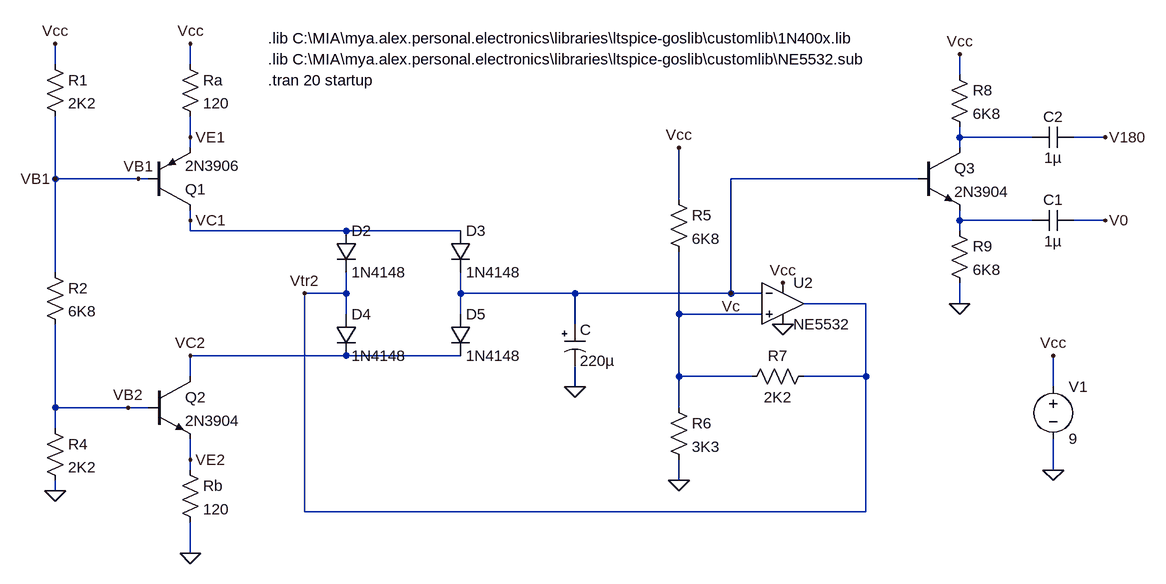
[diagram p0: schematic triangular-wave-generator.asc]
triangular-wave-generator.asc, the LTspice schematic file:
Version 4
SHEET 1 1076 740
WIRE -1696 -192 -1696 -224
WIRE -1488 -192 -1488 -224
WIRE -304 -176 -304 -208
WIRE -1488 -80 -1488 -112
WIRE -304 -80 -304 -96
WIRE -192 -80 -304 -80
WIRE -80 -80 -128 -80
WIRE -1488 -64 -1488 -80
WIRE -304 -64 -304 -80
WIRE -1696 -16 -1696 -112
WIRE -1568 -16 -1696 -16
WIRE -1552 -16 -1568 -16
WIRE -368 -16 -656 -16
WIRE -736 16 -736 -64
WIRE -1488 48 -1488 32
WIRE -304 48 -304 32
WIRE -192 48 -304 48
WIRE -80 48 -128 48
WIRE -1488 64 -1488 48
WIRE -1248 64 -1488 64
WIRE -1072 64 -1248 64
WIRE -304 64 -304 48
WIRE -1696 128 -1696 -16
WIRE -1248 160 -1248 128
WIRE -1248 160 -1312 160
WIRE -1072 160 -1072 128
WIRE -896 160 -1072 160
WIRE -656 160 -656 -16
WIRE -656 160 -896 160
WIRE -608 160 -656 160
WIRE -448 176 -544 176
WIRE -304 176 -304 144
WIRE -1248 192 -1248 160
WIRE -1072 192 -1072 160
WIRE -736 192 -736 96
WIRE -608 192 -736 192
WIRE -896 208 -896 160
WIRE -1248 256 -1488 256
WIRE -1072 256 -1248 256
WIRE -1488 288 -1488 256
WIRE -736 288 -736 192
WIRE -624 288 -736 288
WIRE -448 288 -448 176
WIRE -448 288 -544 288
WIRE -896 304 -896 272
WIRE -160 304 -160 256
WIRE -1696 336 -1696 208
WIRE -1584 336 -1696 336
WIRE -1552 336 -1584 336
WIRE -736 336 -736 288
WIRE -1696 368 -1696 336
WIRE -1488 416 -1488 384
WIRE -1488 432 -1488 416
WIRE -160 432 -160 384
WIRE -736 448 -736 416
WIRE -1696 464 -1696 448
WIRE -1312 496 -1312 160
WIRE -448 496 -448 288
WIRE -448 496 -1312 496
WIRE -1488 560 -1488 512
FLAG -160 432 0
FLAG -896 304 0
FLAG -1488 -224 Vcc
FLAG -1696 -224 Vcc
FLAG -1488 48 VC1
FLAG -1696 -16 VB1
FLAG -160 256 Vcc
FLAG -1488 -80 VE1
FLAG -656 160 Vc
FLAG -1488 560 0
FLAG -1696 464 0
FLAG -1312 160 Vtr2
FLAG -1488 256 VC2
FLAG -1488 416 VE2
FLAG -1584 336 VB2
FLAG -1568 -16 VB1
FLAG -576 144 Vcc
FLAG -576 208 0
FLAG -736 448 0
FLAG -736 -64 Vcc
FLAG -304 176 0
FLAG -80 -80 V180
FLAG -80 48 V0
FLAG -304 -208 Vcc
SYMBOL voltage -160 288 R0
WINDOW 123 0 0 Left 0
WINDOW 39 0 0 Left 0
SYMATTR InstName V1
SYMATTR Value 9
SYMBOL pnp -1552 32 M180
SYMATTR InstName Q1
SYMATTR Value 2N3906
SYMBOL res -1504 -208 R0
SYMATTR InstName Ra
SYMATTR Value 120
SYMBOL polcap -912 208 R0
WINDOW 3 24 56 Left 2
SYMATTR Value 220µ
SYMATTR InstName C
SYMATTR Description Capacitor
SYMATTR Type cap
SYMBOL res -1712 112 R0
SYMATTR InstName R2
SYMATTR Value 6K8
SYMBOL diode -1264 64 R0
SYMATTR InstName D2
SYMATTR Value 1N4148
SYMBOL diode -1088 64 R0
SYMATTR InstName D3
SYMATTR Value 1N4148
SYMBOL diode -1264 192 R0
SYMATTR InstName D4
SYMATTR Value 1N4148
SYMBOL diode -1088 192 R0
SYMATTR InstName D5
SYMATTR Value 1N4148
SYMBOL npn -1552 288 R0
SYMATTR InstName Q2
SYMATTR Value 2N3904
SYMBOL res -1504 416 R0
SYMATTR InstName Rb
SYMATTR Value 120
SYMBOL res -1712 -208 R0
SYMATTR InstName R1
SYMATTR Value 2K2
SYMBOL res -1712 352 R0
SYMATTR InstName R4
SYMATTR Value 2K2
SYMBOL res -752 0 R0
SYMATTR InstName R5
SYMATTR Value 6K8
SYMBOL res -752 320 R0
SYMATTR InstName R6
SYMATTR Value 3K3
SYMBOL res -528 272 R90
WINDOW 0 0 56 VBottom 2
WINDOW 3 32 56 VTop 2
SYMATTR InstName R7
SYMATTR Value 2K2
SYMBOL OpAmps\\opamp2 -576 112 R0
SYMATTR InstName U2
SYMATTR Value NE5532
SYMBOL npn -368 -64 R0
SYMATTR InstName Q3
SYMATTR Value 2N3904
SYMBOL res -320 48 R0
SYMATTR InstName R9
SYMATTR Value 6K8
SYMBOL res -320 -192 R0
SYMATTR InstName R8
SYMATTR Value 6K8
SYMBOL cap -128 -96 R90
WINDOW 0 0 32 VBottom 2
WINDOW 3 32 32 VTop 2
SYMATTR InstName C2
SYMATTR Value 1µ
SYMBOL cap -128 32 R90
WINDOW 0 0 32 VBottom 2
WINDOW 3 32 32 VTop 2
SYMATTR InstName C1
SYMATTR Value 1µ
TEXT -1368 -168 Left 2 !.tran 20 startup
TEXT -1368 -232 Left 2 !.lib C:\\MIA\\mya.alex.personal.electronics\\libraries\\ltspice-goslib\\customlib\\1N400x.lib
TEXT -1368 -200 Left 2 !.lib C:\\MIA\\mya.alex.personal.electronics\\libraries\\ltspice-goslib\\customlib\\NE5532.sub

The netlist it stands for:
* triangular-wave-generator.asc
V1 Vcc 0 9
Q1 VC1 VB1 VE1 0 2N3906
Ra Vcc VE1 120
C Vc 0 220µ
R2 VB1 VB2 6K8
D2 VC1 Vtr2 1N4148
D3 VC1 Vc 1N4148
D4 Vtr2 VC2 1N4148
D5 Vc VC2 1N4148
Q2 VC2 VB2 VE2 0 2N3904
Rb VE2 0 120
R1 Vcc VB1 2K2
R4 VB2 0 2K2
R5 Vcc N003 6K8
R6 N003 0 3K3
R7 Vtr2 N003 2K2
XU2 N003 Vc Vcc 0 Vtr2 NE5532  ; pins In+ In- V+ V- OUT
Q3 N001 Vc N002 0 2N3904
R9 N002 0 6K8
R8 Vcc N001 6K8
C2 V180 N001 1µ
C1 V0 N002 1µ
.model D D
.lib standard.dio
.model NPN NPN
.model PNP PNP
.lib standard.bjt
.tran 20 startup
.lib C:\MIA\mya.alex.personal.electronics\libraries\ltspice-goslib\customlib\1N400x.lib
.lib C:\MIA\mya.alex.personal.electronics\libraries\ltspice-goslib\customlib\NE5532.sub
.backanno
.end